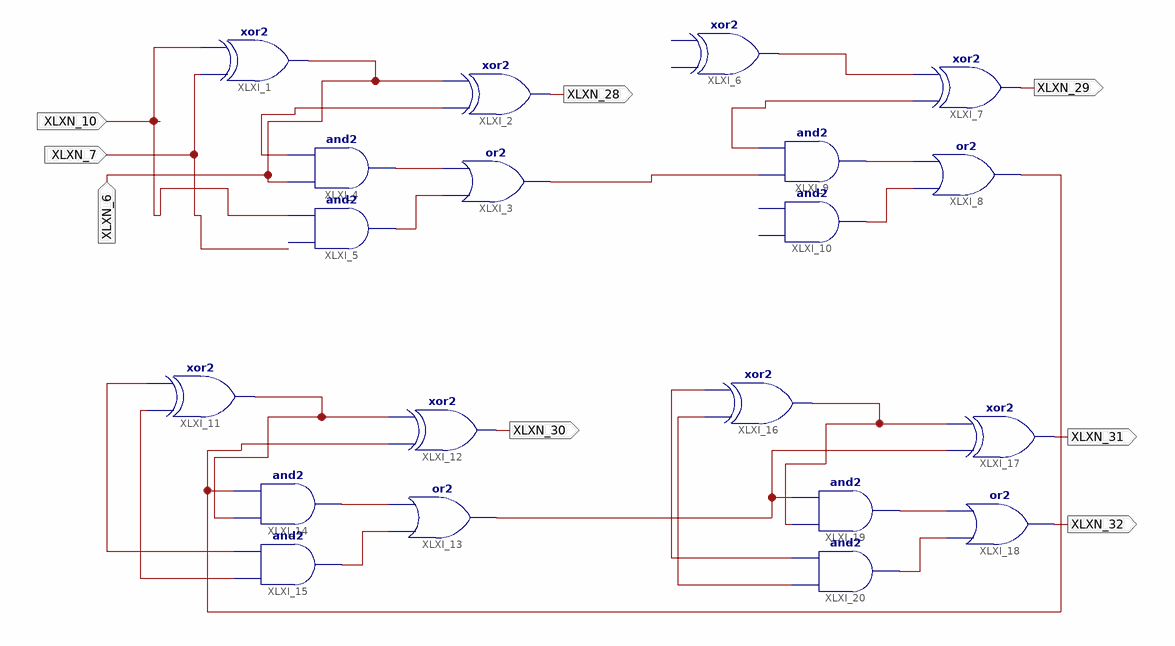
[diagram p0: schematic sheet 1]
// Xilinx ISE schematic Lab7part1.sch (xa9500xl) as structural Verilog: 20 symbols, 8 ports
module Lab7part1 (
  input  XLXN_6,
  input  XLXN_7,
  input  XLXN_10,
  output XLXN_28,
  output XLXN_29,
  output XLXN_30,
  output XLXN_31,
  output XLXN_32
);

  wire XLXN_1, XLXN_2, XLXN_5, XLXN_11, XLXN_12, XLXN_14, XLXN_15, XLXN_16, XLXN_18, XLXN_19, XLXN_20,
       XLXN_23, XLXN_24, XLXN_33, XLXN_35, XLXN_36, XLXN_37, XLXN_39, XLXN_40, XLXN_41;

  xor XLXI_1 (XLXN_6, XLXN_7, XLXN_10);
  xor XLXI_2 (XLXN_28, XLXN_5, XLXN_6);
  or XLXI_3 (XLXN_23, XLXN_2, XLXN_1);
  and XLXI_4 (XLXN_1, XLXN_6, XLXN_5);
  buf XLXI_5 (XLXN_2, XLXN_10);  // and2 open: I0
  // xor2 XLXI_6 has open pins: I0=open, I1=open, O=XLXN_24
  xor XLXI_7 (XLXN_29, XLXN_14, XLXN_24);
  or XLXI_8 (XLXN_18, XLXN_12, XLXN_11);
  and XLXI_9 (XLXN_11, XLXN_23, XLXN_14);
  // and2 XLXI_10 has open pins: I0=open, I1=open, O=XLXN_12
  xor XLXI_11 (XLXN_41, XLXN_33, XLXN_35);
  xor XLXI_12 (XLXN_30, XLXN_18, XLXN_41);
  or XLXI_13 (XLXN_39, XLXN_16, XLXN_15);
  and XLXI_14 (XLXN_15, XLXN_41, XLXN_18);
  and XLXI_15 (XLXN_16, XLXN_33, XLXN_35);
  xor XLXI_16 (XLXN_40, XLXN_37, XLXN_36);
  xor XLXI_17 (XLXN_31, XLXN_39, XLXN_40);
  or XLXI_18 (XLXN_32, XLXN_20, XLXN_19);
  and XLXI_19 (XLXN_19, XLXN_40, XLXN_39);
  and XLXI_20 (XLXN_20, XLXN_37, XLXN_36);
endmodule
